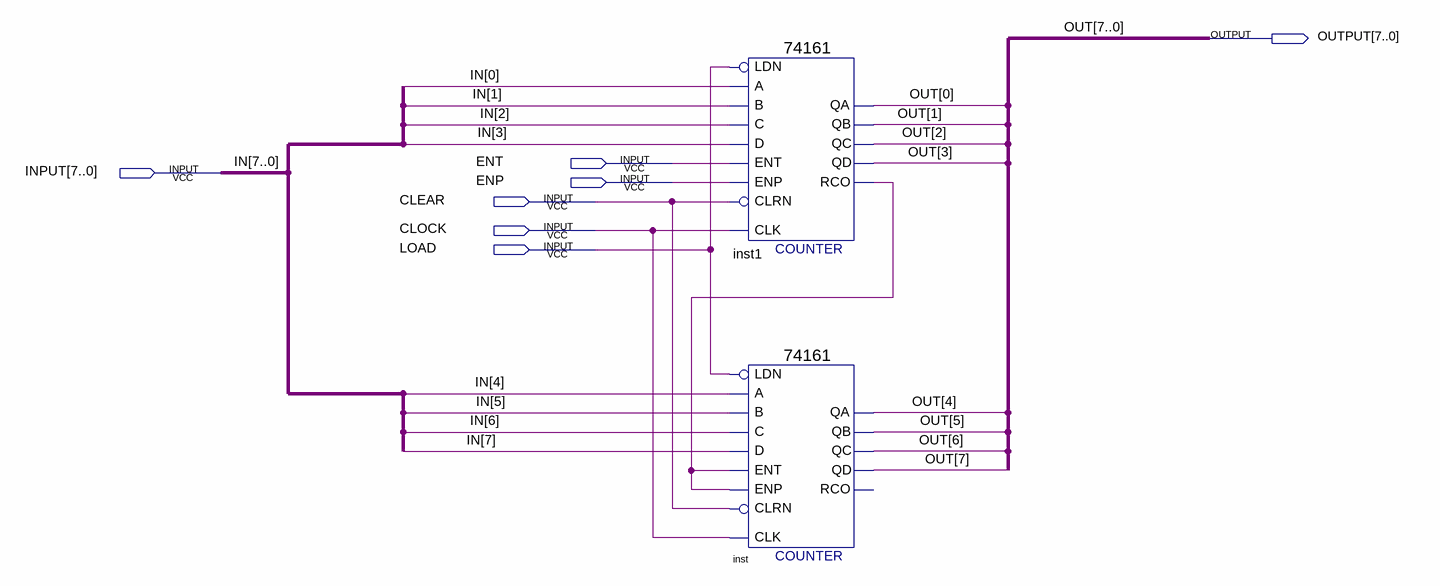
[diagram p0: schematic sheet]
// Quartus schematic upc.bdf as structural Verilog: 2 symbols, 7 pins
module upc (
  input  ENT,
  input  [7:0] INPUT,
  input  ENP,
  input  CLEAR,
  input  CLOCK,
  input  LOAD,
  output [7:0] OUTPUT
);

  wire inst1_rco;

  \74161  inst1 (
    .CLRN(CLEAR), .CLK(CLOCK), .ENP(ENP), .LDN(LOAD), .A(INPUT[0]), .D(INPUT[3]), .ENT(ENT), .B(INPUT[1]),
    .C(INPUT[2]), .QD(OUTPUT[3]), .QC(OUTPUT[2]), .QB(OUTPUT[1]), .QA(OUTPUT[0]), .RCO(inst1_rco));
  \74161  inst (
    .CLRN(CLEAR), .CLK(CLOCK), .ENP(inst1_rco), .LDN(LOAD), .A(INPUT[4]), .D(INPUT[7]), .ENT(inst1_rco),
    .B(INPUT[5]), .C(INPUT[6]), .QD(OUTPUT[7]), .QC(OUTPUT[6]), .QB(OUTPUT[5]), .QA(OUTPUT[4]));  // open: RCO

  // Other names for the same wires on the sheet: IN[7:0] = INPUT; OUT[7:0] = OUTPUT
endmodule
